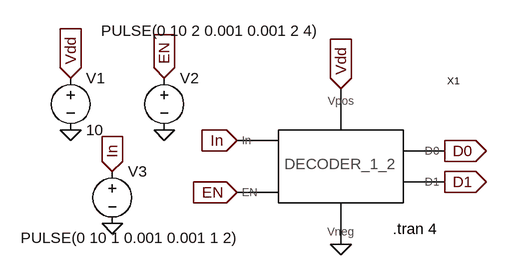
[diagram p0: schematic DECODER_1_2_TESTING.asc]
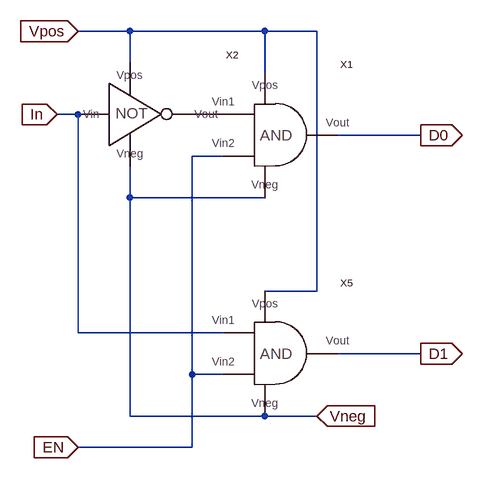
[diagram p1: sub-circuit decoder_1_2_sym.asc]
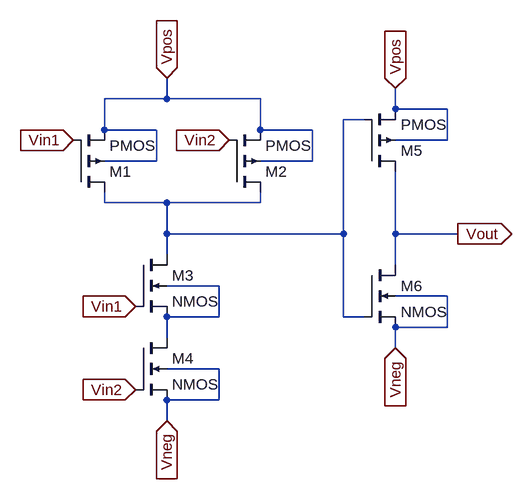
[diagram p2: sub-circuit and_sym.asc]
DECODER_1_2_TESTING.asc, the LTspice schematic file:
Version 4
SHEET 1 880 680
FLAG 512 160 D0
IOPIN 512 160 Out
FLAG 512 208 D1
IOPIN 512 208 Out
FLAG 192 144 In
IOPIN 192 144 In
FLAG 352 64 Vdd
IOPIN 352 64 In
FLAG 192 224 EN
IOPIN 192 224 In
FLAG -64 48 Vdd
IOPIN -64 48 In
FLAG 80 48 EN
IOPIN 80 48 In
FLAG 0 192 In
IOPIN 0 192 In
FLAG -64 128 0
FLAG 80 128 0
FLAG 0 272 0
FLAG 352 304 0
SYMBOL DECODER_1_2_SYM 352 176 R0
SYMATTR InstName X1
SYMBOL voltage -64 32 R0
WINDOW 123 0 0 Left 0
WINDOW 39 0 0 Left 0
SYMATTR InstName V1
SYMATTR Value 10
SYMBOL voltage 80 32 R0
WINDOW 3 -97 -57 Left 2
WINDOW 123 0 0 Left 0
WINDOW 39 0 0 Left 0
SYMATTR InstName V2
SYMATTR Value PULSE(0 10 2 0.001 0.001 2 4)
SYMBOL voltage 0 176 R0
WINDOW 3 -141 118 Left 2
WINDOW 123 0 0 Left 0
WINDOW 39 0 0 Left 0
SYMATTR InstName V3
SYMATTR Value PULSE(0 10 1 0.001 0.001 1 2)
TEXT 432 280 Left 2 !.tran 4

decoder_1_2_sym.asc, the sub-circuit schematic file:
Version 4
SHEET 1 880 728
WIRE 64 -16 -16 -16
WIRE 272 -16 64 -16
WIRE 352 -16 272 -16
WIRE 64 32 64 -16
WIRE 272 48 272 -16
WIRE -16 112 -48 112
WIRE 512 144 384 144
WIRE 208 176 160 176
WIRE 64 240 64 192
WIRE 272 240 64 240
WIRE 352 384 352 -16
WIRE 352 384 272 384
WIRE -16 448 -16 112
WIRE 208 448 -16 448
WIRE 512 480 384 480
WIRE 160 512 160 176
WIRE 208 512 160 512
WIRE 64 576 64 240
WIRE 272 576 64 576
WIRE 352 576 272 576
WIRE 160 624 160 512
WIRE 160 624 -16 624
FLAG -48 112 In
IOPIN -48 112 In
FLAG -16 -16 Vpos
IOPIN -16 -16 In
FLAG -16 624 EN
IOPIN -16 624 In
FLAG 512 144 D0
IOPIN 512 144 Out
FLAG 512 480 D1
IOPIN 512 480 Out
FLAG 352 576 Vneg
IOPIN 352 576 In
SYMBOL AND_SYM 288 144 R0
SYMATTR InstName X1
SYMBOL NOT_SYM 64 112 R0
SYMATTR InstName X2
SYMBOL AND_SYM 288 480 R0
SYMATTR InstName X5

and_sym.asc, the sub-circuit schematic file:
Version 4
SHEET 1 880 680
WIRE 272 -16 272 -48
WIRE 272 -16 176 -16
WIRE 416 -16 272 -16
WIRE 624 0 624 -32
WIRE 704 0 624 0
WIRE 576 16 544 16
WIRE 176 32 176 -16
WIRE 256 32 176 32
WIRE 416 32 416 -16
WIRE 496 32 416 32
WIRE 704 48 704 0
WIRE 704 48 624 48
WIRE 256 80 256 32
WIRE 256 80 176 80
WIRE 496 80 496 32
WIRE 496 80 416 80
WIRE 176 144 176 128
WIRE 272 144 176 144
WIRE 416 144 416 128
WIRE 416 144 272 144
WIRE 272 192 272 144
WIRE 544 192 544 16
WIRE 544 192 272 192
WIRE 624 192 624 96
WIRE 720 192 624 192
WIRE 272 224 272 192
WIRE 624 240 624 192
WIRE 352 272 272 272
WIRE 704 288 624 288
WIRE 352 320 352 272
WIRE 352 320 272 320
WIRE 544 320 544 192
WIRE 576 320 544 320
WIRE 704 336 704 288
WIRE 704 336 624 336
WIRE 272 352 272 320
WIRE 624 368 624 336
WIRE 352 400 272 400
WIRE 352 448 352 400
WIRE 352 448 272 448
WIRE 272 480 272 448
FLAG 272 -48 Vpos
IOPIN 272 -48 In
FLAG 128 48 Vin1
IOPIN 128 48 In
FLAG 224 304 Vin1
IOPIN 224 304 In
FLAG 224 432 Vin2
IOPIN 224 432 In
FLAG 720 192 Vout
IOPIN 720 192 Out
FLAG 368 48 Vin2
IOPIN 368 48 In
FLAG 272 480 Vneg
IOPIN 272 480 In
FLAG 624 -32 Vpos
IOPIN 624 -32 In
FLAG 624 368 Vneg
IOPIN 624 368 In
SYMBOL pmos4 128 128 M180
SYMATTR InstName M1
SYMBOL pmos4 368 128 M180
SYMATTR InstName M2
SYMBOL nmos4 224 224 R0
SYMATTR InstName M3
SYMBOL nmos4 224 352 R0
SYMATTR InstName M4
SYMBOL pmos4 576 96 M180
SYMATTR InstName M5
SYMBOL nmos4 576 240 R0
SYMATTR InstName M6

The netlist it stands for:
* DECODER_1_2_TESTING.asc
XX1 In EN Vdd 0 D0 D1 decoder_1_2_sym
V1 Vdd 0 10
V2 EN 0 PULSE(0 10 2 0.001 0.001 2 4)
V3 In 0 PULSE(0 10 1 0.001 0.001 1 2)

* block symbol definitions
.subckt decoder_1_2_sym In EN Vpos Vneg D0 D1
XX1 P001 EN Vpos Vneg D0 and_sym
XX2 In Vpos P001 Vneg NOT_SYM  ; pins Vin Vpos Vout Vneg
XX5 In EN Vpos Vneg D1 and_sym
.ends decoder_1_2_sym

.subckt and_sym Vin1 Vin2 Vpos Vneg Vout
M1 N001 Vin1 Vpos Vpos PMOS
M2 N001 Vin2 Vpos Vpos PMOS
M3 N001 Vin1 N002 N002 NMOS
M4 N002 Vin2 Vneg Vneg NMOS
M5 Vout N001 Vpos Vpos PMOS
M6 Vout N001 Vneg Vneg NMOS
.ends and_sym

.model NMOS NMOS
.model PMOS PMOS
.lib standard.mos
.tran 4
.backanno
.end

* Results of the author's LTspice run, read from the files saved beside the schematic
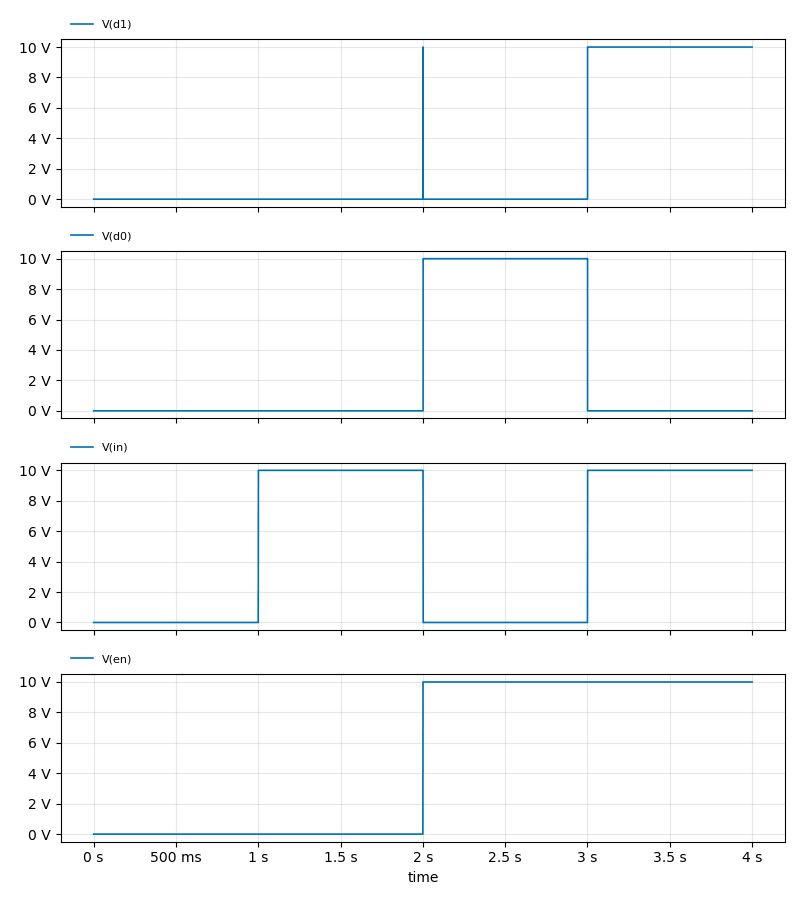
[diagram p3: Transient Analysis of DECODER_1_2_TESTING.asc, plotted from the saved traces]
* Transient Analysis, 1 run:
*   V(d1): min 0 V, max 10 V, average 2.501 V, rms 5.001 V, last 10 V
*   V(d0): min 0 V, max 10 V, average 2.497 V, rms 4.997 V, last 0 V
*   V(in): min 0 V, max 10 V, average 5.001 V, rms 7.071 V, last 10 V
*   V(en): min 0 V, max 10 V, average 4.999 V, rms 7.07 V, last 10 V